# EAGLE design RatDBS (EAGLE 7.3.0)
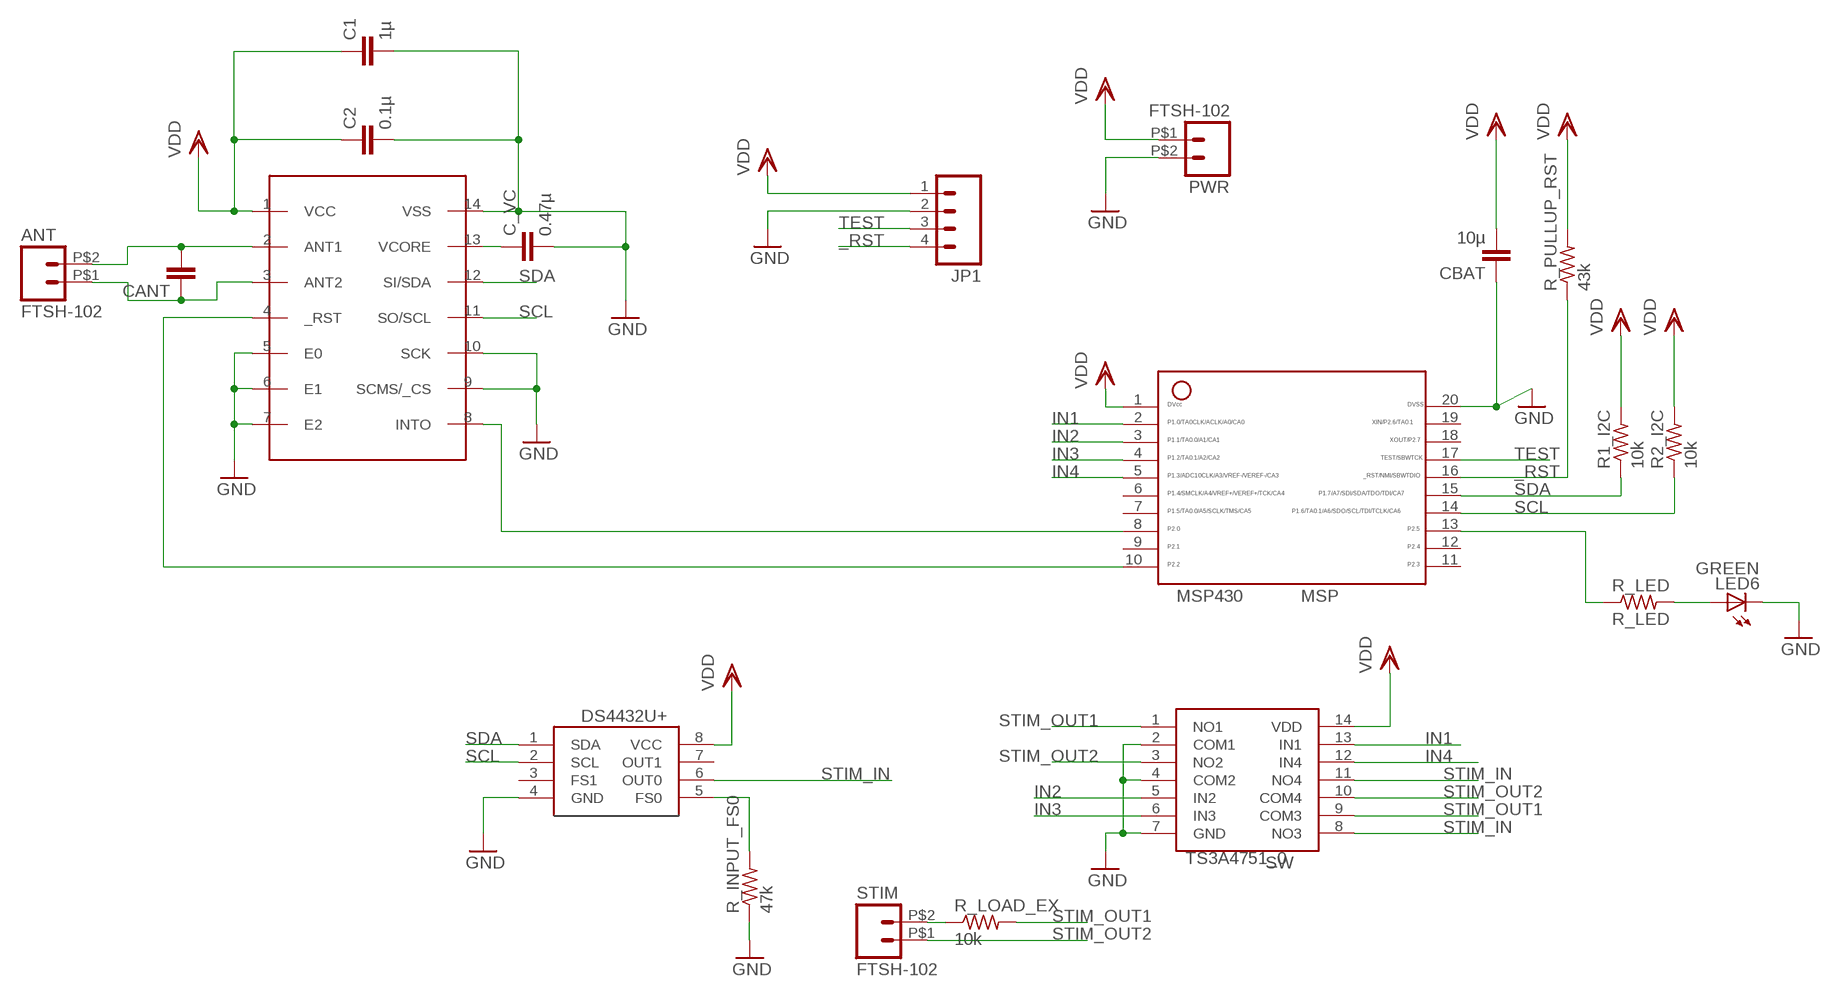
[diagram p0: schematic, sheet 1]

## Parts
ANT  FTSH-102  [FTSH-102-DH]
C1  1µ  C-EUC0603  [C0603]
C2  0.1µ  C-EUC0603  [C0603]
C_VC  0.47µ  C-EUC0603  [C0603]
CANT  C-EUC0603  [C0603]
CBAT  10µ  C-EUC0603  [C0603]
DS4432U+  DS4432U+  [8_PIN]
JP1  M041.27MM  [1X04-1.27MM]
LED6  GREEN  LED1206  [LED-1206]
MSP430  MSP  MSP430  [20_PIN]
PWR  FTSH-102  [FTSH-102-DH]
R1_I2C  10k  R-US_R0603  [R0603]
R2_I2C  10k  R-US_R0603  [R0603]
R_INPUT_FS0  47k  R-US_R0603  [R0603]
R_LED  R_LED  R-US_R0603  [R0603]
R_LOAD_EX  10k  R-US_R0603  [R0603]
R_PULLUP_RST  43k  R-US_R0603  [R0603]
STIM  FTSH-102  [FTSH-102-DH]
TS3A4751_0  SW  TS3A4751  [14_PIN]
U$1  RF  RF430CL330H  [PW_R-PDSO-G14]

## Nets
_RST: JP1.4 MSP430.16 R_PULLUP_RST.1
GND: C1.2 C2.2 C_VC.2 CBAT.1 DS4432U+.4(GND) JP1.2 LED6.C MSP430.20 PWR.P$2 R_INPUT_FS0.1 TS3A4751_0.2(COM1) TS3A4751_0.4(COM2) TS3A4751_0.7(GND) U$1.5(E0) U$1.6(E1) U$1.7(E2) U$1.9(SCMS/_CS) U$1.10(SCK) U$1.14(VSS)
IN1: MSP430.2 TS3A4751_0.13(IN1)
IN2: MSP430.3 TS3A4751_0.5(IN2)
IN3: MSP430.4 TS3A4751_0.6(IN3)
IN4: MSP430.5 TS3A4751_0.12(IN4)
N$1: C_VC.1 U$1.13(VCORE)
N$2: ANT.P$2 CANT.2 U$1.2(ANT1)
N$3: MSP430.8 U$1.8(INTO)
N$4: R_LOAD_EX.1 STIM.P$2
N$5: MSP430.13 R_LED.1
N$6: MSP430.7
N$7: MSP430.10 U$1.4(_RST)
N$8: DS4432U+.5(FS0) R_INPUT_FS0.2
N$9: LED6.A R_LED.2
N$12: ANT.P$1 CANT.1 U$1.3(ANT2)
SCL: DS4432U+.2(SCL) MSP430.14 R2_I2C.1 U$1.11(SO/SCL)
SDA: DS4432U+.1(SDA) MSP430.15 R1_I2C.1 U$1.12(SI/SDA)
STIM_IN: DS4432U+.6(OUT0) TS3A4751_0.8(NO3) TS3A4751_0.11(NO4)
STIM_OUT1: R_LOAD_EX.2 TS3A4751_0.1(NO1) TS3A4751_0.9(COM3)
STIM_OUT2: STIM.P$1 TS3A4751_0.3(NO2) TS3A4751_0.10(COM4)
TEST: JP1.3 MSP430.17
VDD: C1.1 C2.1 CBAT.2 DS4432U+.8(VCC) JP1.1 MSP430.1 PWR.P$1 R1_I2C.2 R2_I2C.2 R_PULLUP_RST.2 TS3A4751_0.14(VDD) U$1.1(VCC)
Unconnected: DS4432U+.3(FS1) DS4432U+.7(OUT1) MSP430.6 MSP430.9 MSP430.11 MSP430.12 MSP430.18 MSP430.19

## Library data of the parts
ANT PWR STIM = Samtec50Mil:FTSH-102
C1 C2 C_VC CANT CBAT = rcl:C-EU: CAPACITOR, European symbol
DS4432U+ = RatDBS:DS4432U+: DS4432U+ current DAC
JP1 = SparkFun:M04: Header 4 Standard 4-pin 0.1" header. Use with straight break away headers (SKU : PRT-00116), right angle break away headers (PRT-00553), swiss pins (PRT-00743), machine pins (PRT-00117), and female headers (PRT-00115). Molex polarized connector foot print use with SKU : PRT-08231 with associated crimp pins and housings.
LED6 = SparkFun-LED:LED: LEDs Standard schematic elements and footprints for 5mm, 3mm, 1206, and 0603 sized LEDs. 5mm - Spark Fun Electronics SKU : COM-00529 (and others)
MSP430 = RatDBS:MSP430: MSP430 20 pins
R1_I2C R2_I2C R_INPUT_FS0 R_LED R_LOAD_EX R_PULLUP_RST = BiphasicBoard:R-US_: RESISTOR, American symbol
TS3A4751_0 = BiphasicBoard:TS3A4751: TS3A4751 Quad Switch
U$1 = RF430CL330H:RF430CL330H

## Board
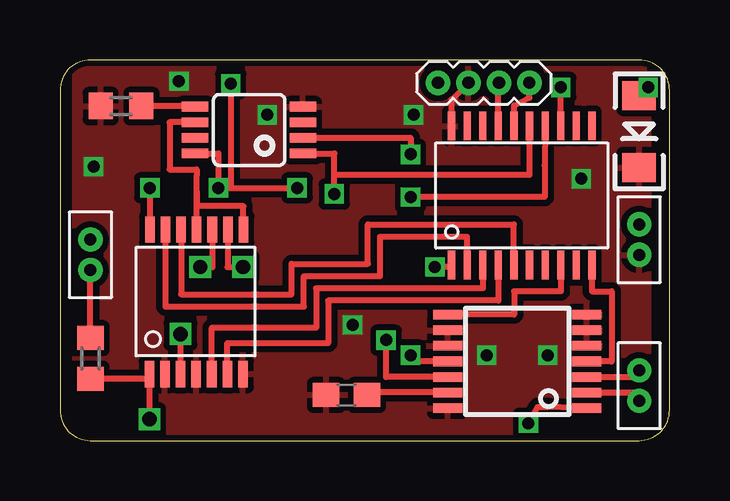
[diagram p1: board, top side]
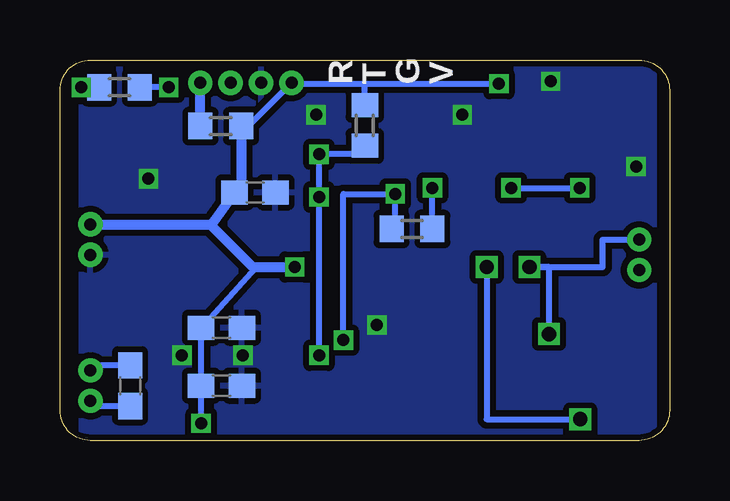
[diagram p2: board, bottom side, seen from below]

Size 25.4 x 15.88 mm. Coordinates in mm from the lower left corner, seen from the top.
Outline: 0,14.61 0,1.27 arc90 1.27,0 24.13,0 arc90 25.4,1.27 25.4,14.61 arc90 24.13,15.88 1.27,15.88 arc90 0,14.61
Copper layers (1*16): Top 0.035mm / dielectric 1.5mm / Bottom 0.035mm
Design rules "Seeed_DRU *": minimum track width 8mil, minimum drill 12mil, track to track 8mil, track to pad 8mil, pad to pad 8mil, via to via 8mil, smd to smd 0mil, copper to edge 10mil, drill to drill 10mil, minimum pad ring 10mil, minimum via ring 6mil, stop-mask expansion 2mil, vias tented up to drill 100mil, thermal gap 10mil

### Footprints (pad centres in the part's own frame; a part is rotated, then mirrored left to right if it is on the bottom)
FTSH-102-DH = drill 0.5 pad 1: P$1 -0.635,0; P$2 0.635,0
C0603 = smd 1.1 x 1: 1 -0.85,0; 2 0.85,0
8_PIN = smd 1.1 x 0.4: 1 -2.25,0.975; 2 -2.25,0.325; 3 -2.25,-0.325; 4 -2.25,-0.975; 5 2.25,-0.975; 6 2.25,-0.325; 7 2.25,0.325; 8 2.25,0.975
1X04-1.27MM = drill 0.508 pad 1: 1 0,0; 2 1.27,0; 3 2.54,0; 4 3.81,0
LED-1206 = smd 1.2 x 1.4: A -1.5,0; C 1.5,0
20_PIN = smd 0.3 x 1.2: 1 -2.925,-2.9; 2 -2.275,-2.9; 3 -1.625,-2.9; 4 -0.975,-2.9; 5 -0.325,-2.9; 6 0.325,-2.9; 7 0.975,-2.9; 8 1.625,-2.9; 9 2.275,-2.9; 10 2.925,-2.9; 11 2.925,2.9; 12 2.275,2.9; 13 1.625,2.9; 14 0.975,2.9; 15 0.325,2.9; 16 -0.325,2.9; 17 -0.975,2.9; 18 -1.625,2.9; 19 -2.275,2.9; 20 -2.925,2.9
R0603 = smd 1 x 1.1: 1 -0.85,0; 2 0.85,0
14_PIN = smd 1.1 x 0.4: 1 -3.26,1.165; 2 -3.26,0.515; 3 -3.26,-0.135; 4 -3.26,-0.785; 5 -3.26,-1.435; 6 -3.26,-2.085; 7 -3.26,-2.735; 8 2.77,-2.755; 9 2.77,-2.105; 10 2.77,-1.455; 11 2.77,-0.805; 12 2.77,-0.155; 13 2.77,0.495; 14 2.77,1.145
PW_R-PDSO-G14 = smd 0.4 x 1.2: 1 -1.95,-2.9; 2 -1.3,-2.9; 3 -0.65,-2.9; 4 0,-2.9; 5 0.65,-2.9; 6 1.3,-2.9; 7 1.95,-2.9; 8 1.95,2.9; 9 1.3,2.9; 10 0.65,2.9; 11 0,2.9; 12 -0.65,2.9; 13 -1.3,2.9; 14 -1.95,2.9

### Placement (x,y rotation side)
ANT  24.13,2.29 270 top
C1  18.67,4.7 0 bottom
C2  18.67,2.29 0 bottom
C_VC  11.94,1.91 180 top
CANT  22.48,2.29 270 bottom
CBAT  17.27,10.35 180 bottom
DS4432U+  7.87,12.95 180 top
JP1  15.75,14.92 0 top
LED6  24.13,12.89 270 top
MSP430  19.24,10.22 0 top
PWR  24.13,8.38 270 top
R1_I2C  10.73,8.83 0 bottom
R2_I2C  12.7,13.14 90 bottom
R_INPUT_FS0  2.54,13.96 0 top
R_LED  22.92,14.73 180 bottom
R_LOAD_EX  1.27,3.43 270 top
R_PULLUP_RST  18.7,13.12 0 bottom
STIM  1.27,7.75 270 top
TS3A4751_0  4.89,6.03 90 top
U$1  19.05,3.3 90 top

### Tracks (layer width: path | path; a pad name or v marks a point on that pad's centre or on a via)
_RST
  Top 0.254: MSP430.16 18.92,13.97 19.56,14.29 19.55,14.41 JP1.4
  Bottom 0.406: R_PULLUP_RST.1 JP1.4
GND  (via drill 0.5)
  Top 0.254: MSP430.20 16.32,14.22 JP1.2
  other vias: 14.73,13.59 4.95,14.99 21.72,10.92 1.4,11.43 8.64,13.59 12.19,4.83 20.32,3.56 17.78,3.56
  pour Top (isolate 0.254): 0.64,15.75 24.51,15.75 24.51,0 0.64,0
  pour Bottom (isolate 0.254): 0.64,15.75 24.51,15.75 24.51,0 0.64,0
IN1
  Top 0.254: TS3A4751_0.13 4.39,5.59 10.16,5.59 10.16,6.86 13.34,6.86 13.34,8.51 16.97,8.51 MSP430.2
IN2
  Top 0.254: TS3A4751_0.5 6.32,4.7 10.67,4.7 10.67,6.35 17.62,6.35 MSP430.3
IN3
  Top 0.254: TS3A4751_0.6 6.97,4.06 11.18,4.06 11.18,5.84 18.27,5.84 MSP430.4
IN4
  Top 0.254: MSP430.5 18.92,9.02 12.83,9.02 12.83,7.37 9.65,7.37 9.65,6.1 5.04,6.1 TS3A4751_0.12
N$1
  Top 0.254: U$1.13 12.79,2 C_VC.1
N$2
  Top 0.254: U$1.2 24.13,2 ANT.P$2
  Bottom 0.254: CANT.2 24.13,1.44 ANT.P$2
N$3
  Top 0.254: MSP430.8 20.87,6.22 18.92,6.22 18.92,5.25 U$1.8
N$4
  Top 0.254: R_LOAD_EX.1 STIM.P$2
N$5  (via drill 0.5)
  Top 0.254: MSP430.13 v20.87,14.73
  Bottom 0.254: v20.87,14.73 R_LED.1
N$7
  Top 0.254: U$1.4 22.99,3.3 22.99,6.22 22.16,6.22 MSP430.10
N$8
  Top 0.254: DS4432U+.5 5.62,13.96 R_INPUT_FS0.2
N$9  (via drill 0.5)
  Top 0.254: LED6.A 24.13,14.61 v24.51,14.73
  Bottom 0.254: R_LED.2 23.77,14.52 | v24.51,14.73 R_LED.2 | 23.75,14.86 R_LED.2
N$12
  Top 0.254: U$1.3 24.13,2.65 ANT.P$1
  Bottom 0.254: CANT.1 24.13,3.14 ANT.P$1
SCL  (via drill 0.5)
  Top 0.254: MSP430.14 20.19,11.47 20.19,10.16 v14.61,10.16 | U$1.11 14.86,3.3 v14.61,3.56 | DS4432U+.2 14.61,12.63 v14.61,11.94
  Bottom 0.254: v14.61,3.56 v14.61,10.16 v14.61,11.94 12.7,11.94 12.65,12.04 12.65,12.19 R2_I2C.1
SDA  (via drill 0.5)
  Top 0.254: DS4432U+.1 11.43,11.98 11.43,11.09 | 11.43,11.09 19.57,11.09 MSP430.15 | U$1.12 13.59,2.65 v13.59,4.19 | v11.43,10.29 11.43,11.09
  Bottom 0.254: v13.59,4.19 13.59,10.29 v11.43,10.29 11.43,8.83 R1_I2C.1
STIM_IN
  Top 0.254: TS3A4751_0.11 5.69,11.05 | 5.69,11.05 5.71,9.78 7.64,9.78 TS3A4751_0.8 | DS4432U+.6 4.57,13.28 4.57,11.3 5.69,11.3 5.69,11.05
STIM_OUT1  (via drill 0.6)
  Top 0.254: 3.72,2.58 v3.72,0.89 | TS3A4751_0.1 3.72,2.58 | 3.72,2.58 R_LOAD_EX.2 | TS3A4751_0.9 6.99,7.24 v7.62,7.24
  Bottom 0.254: v7.62,7.24 7.62,0.89 v3.72,0.89
STIM_OUT2  (via drill 0.6)
  Top 0.254: TS3A4751_0.10 6.35,7.24 v5.84,7.24 | TS3A4751_0.3 v5.02,4.45 5.08,4.45
  Bottom 0.254: STIM.P$1 2.79,8.38 2.79,7.24 v5.84,7.24 5.02,7.24 v5.02,4.45
TEST
  Top 0.254: MSP430.17 18.27,14.03 JP1.3
VDD  (via drill 0.5)
  Top 0.254: U$1.1 20.32,1.4 19.9,1.4 v19.52,0.72 | MSP430.1 16.32,7.24 v15.62,7.24 | DS4432U+.8 6.6,11.98 v6.6,10.54 7.11,10.54 | v3.74,10.54 TS3A4751_0.14 | v7.11,14.88 7.11,10.54 | 7.11,10.54 v9.88,10.54
  Bottom 0.254: v19.52,0.72 C2.1 C1.1 17.23,7.24 17.14,7.24 | R_PULLUP_RST.2 17.55,13.12 JP1.1 15.85,14.94 15.75,14.88 12.7,14.88 | v6.6,10.54 v3.74,10.54 | R1_I2C.2 v9.88,10.54 | 12.7,14.88 v7.11,14.88 | R2_I2C.2 12.7,14.88
  Bottom 0.406: v15.62,7.24 17.14,7.24 17.36,7.24 19.14,9.02 | PWR.P$1 19.14,9.02 | 19.14,9.02 19.07,9.02 CBAT.2 17.85,10.62 R_PULLUP_RST.2

### Text on the board
bNames: V | G | T | R
tDocu: STIM | GND
bDocu: NFC-RDBS v1.1 / Kemere Lab / (C)2015 | + | -